# Altium schematic sheet Z7_POWER1.SchDoc
size A3
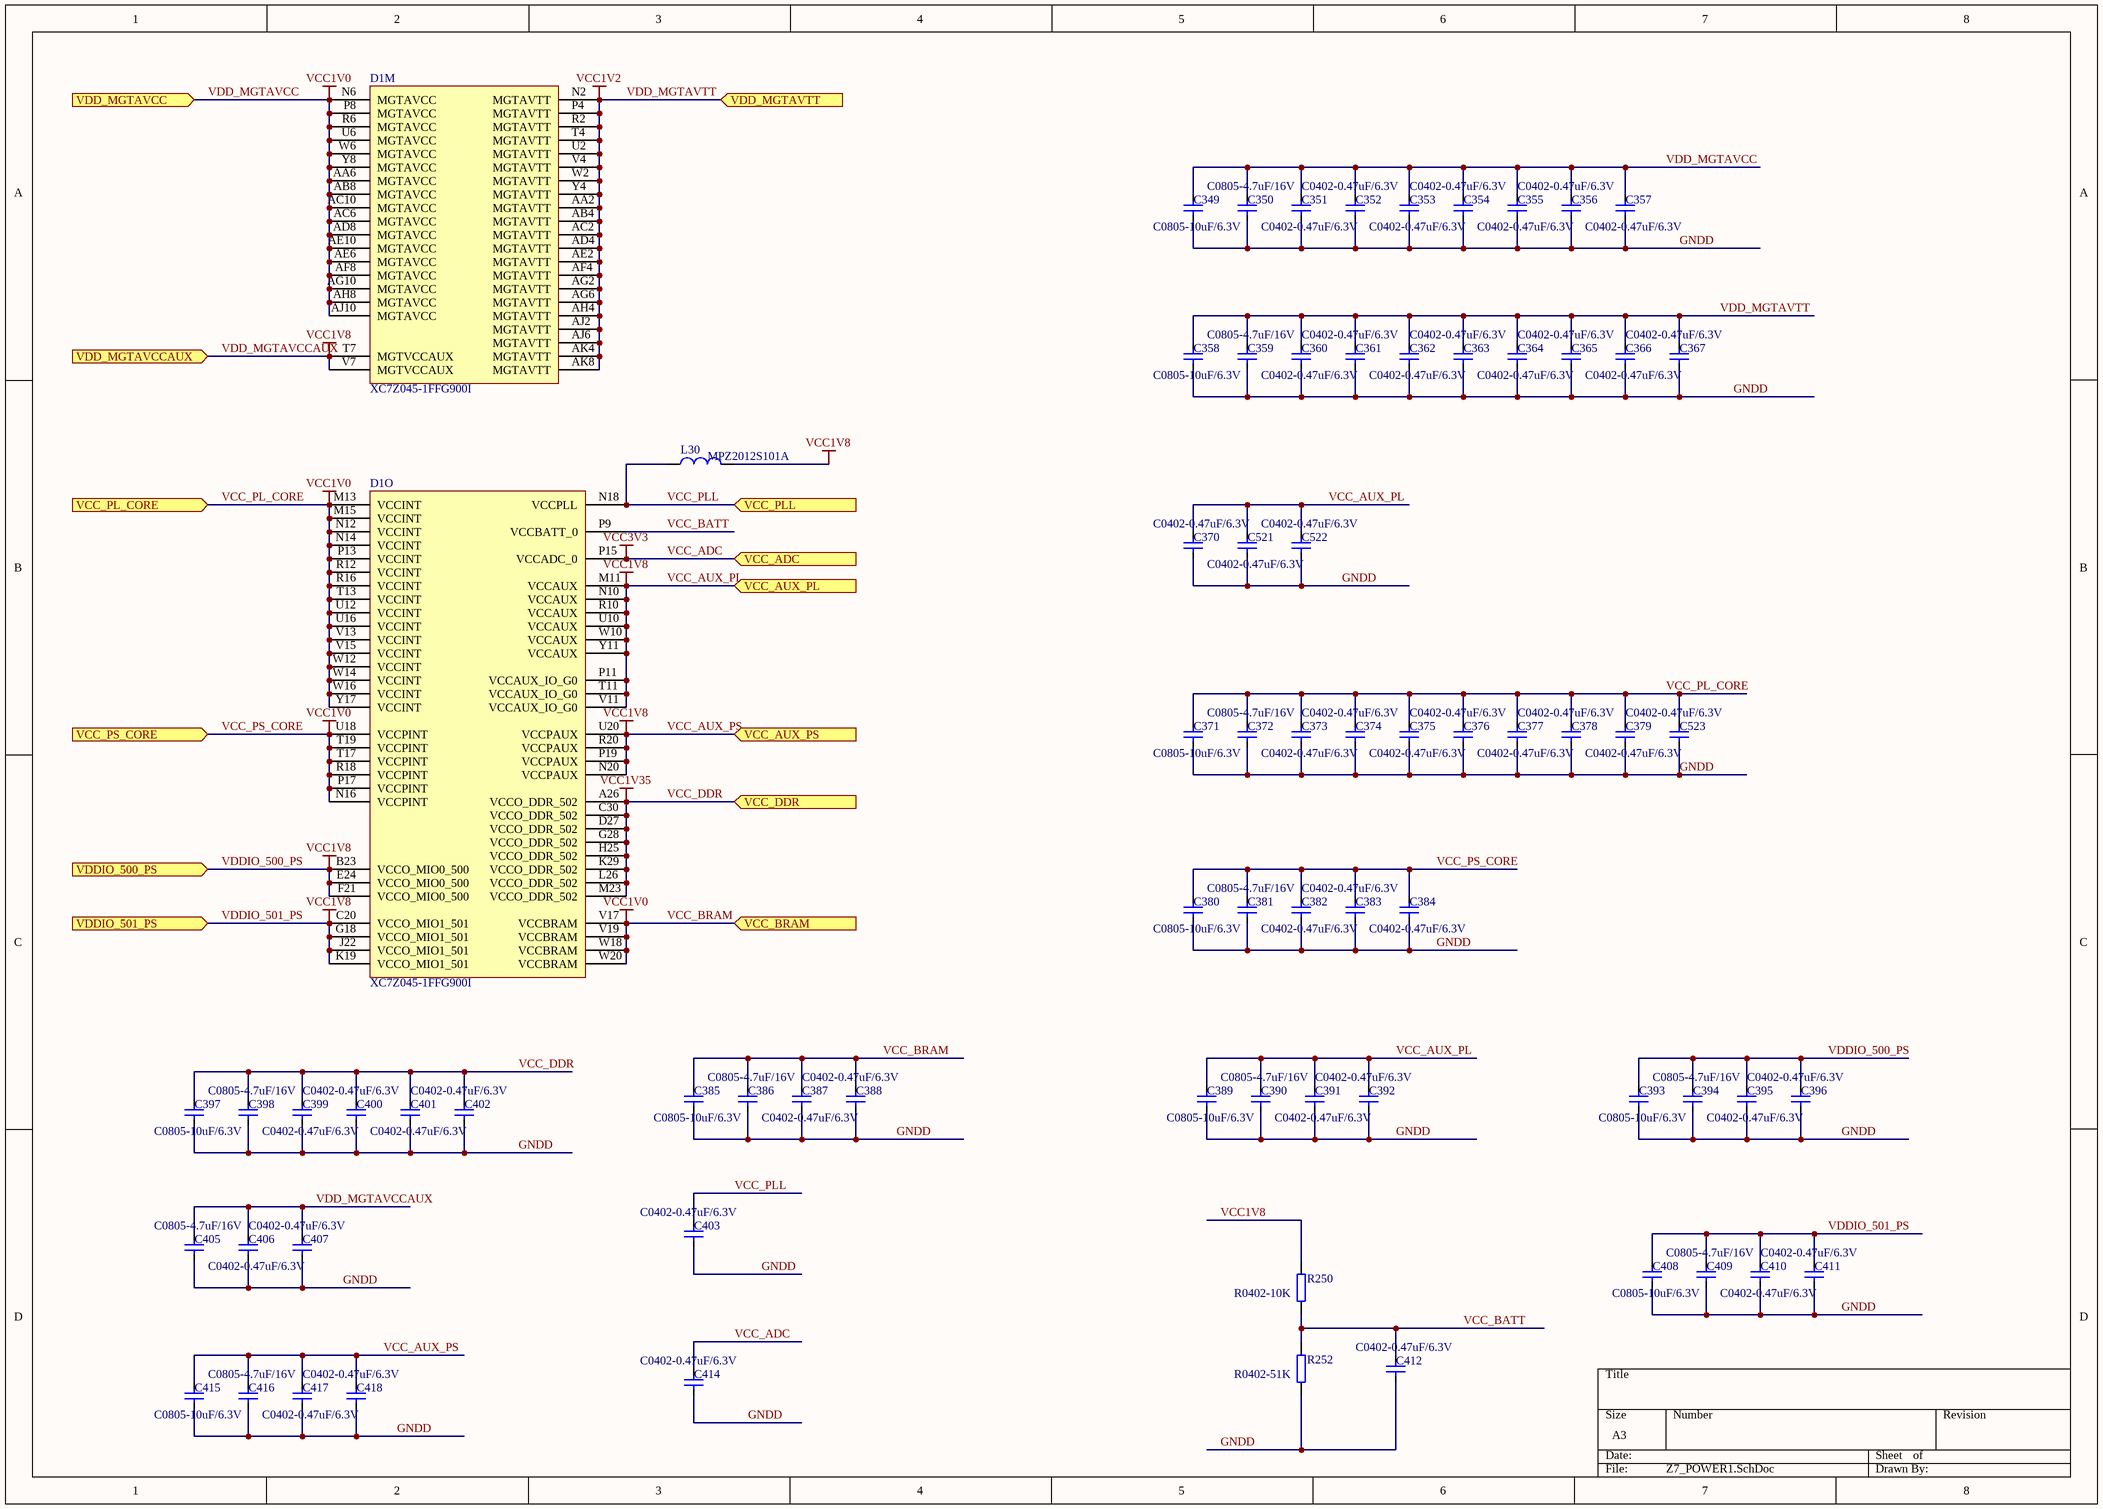
[diagram p0: Z7_POWER1.SchDoc]

## Parts
C349  C0805-10uF/6.3V  [C0805]
C350  C0805-4.7uF/16V  [C0805]
C351  C0402-0.47uF/6.3V  [C0402]
C352  C0402-0.47uF/6.3V  [C0402]
C353  C0402-0.47uF/6.3V  [C0402]
C354  C0402-0.47uF/6.3V  [C0402]
C355  C0402-0.47uF/6.3V  [C0402]
C356  C0402-0.47uF/6.3V  [C0402]
C357  C0402-0.47uF/6.3V  [C0402]
C358  C0805-10uF/6.3V  [C0805]
C359  C0805-4.7uF/16V  [C0805]
C360  C0402-0.47uF/6.3V  [C0402]
C361  C0402-0.47uF/6.3V  [C0402]
C362  C0402-0.47uF/6.3V  [C0402]
C363  C0402-0.47uF/6.3V  [C0402]
C364  C0402-0.47uF/6.3V  [C0402]
C365  C0402-0.47uF/6.3V  [C0402]
C366  C0402-0.47uF/6.3V  [C0402]
C367  C0402-0.47uF/6.3V  [C0402]
C370  C0402-0.47uF/6.3V  [C0402]
C371  C0805-10uF/6.3V  [C0805]
C372  C0805-4.7uF/16V  [C0805]
C373  C0402-0.47uF/6.3V  [C0402]
C374  C0402-0.47uF/6.3V  [C0402]
C375  C0402-0.47uF/6.3V  [C0402]
C376  C0402-0.47uF/6.3V  [C0402]
C377  C0402-0.47uF/6.3V  [C0402]
C378  C0402-0.47uF/6.3V  [C0402]
C379  C0402-0.47uF/6.3V  [C0402]
C380  C0805-10uF/6.3V  [C0805]
C381  C0805-4.7uF/16V  [C0805]
C382  C0402-0.47uF/6.3V  [C0402]
C383  C0402-0.47uF/6.3V  [C0402]
C384  C0402-0.47uF/6.3V  [C0402]
C385  C0805-10uF/6.3V  [C0805]
C386  C0805-4.7uF/16V  [C0805]
C387  C0402-0.47uF/6.3V  [C0402]
C388  C0402-0.47uF/6.3V  [C0402]
C389  C0805-10uF/6.3V  [C0805]
C390  C0805-4.7uF/16V  [C0805]
C391  C0402-0.47uF/6.3V  [C0402]
C392  C0402-0.47uF/6.3V  [C0402]
C393  C0805-10uF/6.3V  [C0805]
C394  C0805-4.7uF/16V  [C0805]
C395  C0402-0.47uF/6.3V  [C0402]
C396  C0402-0.47uF/6.3V  [C0402]
C397  C0805-10uF/6.3V  [C0805]
C398  C0805-4.7uF/16V  [C0805]
C399  C0402-0.47uF/6.3V  [C0402]
C400  C0402-0.47uF/6.3V  [C0402]
C401  C0402-0.47uF/6.3V  [C0402]
C402  C0402-0.47uF/6.3V  [C0402]
C403  C0402-0.47uF/6.3V  [C0402]
C405  C0805-4.7uF/16V  [C0805]
C406  C0402-0.47uF/6.3V  [C0402]
C407  C0402-0.47uF/6.3V  [C0402]
C408  C0805-10uF/6.3V  [C0805]
C409  C0805-4.7uF/16V  [C0805]
C410  C0402-0.47uF/6.3V  [C0402]
C411  C0402-0.47uF/6.3V  [C0402]
C412  C0402-0.47uF/6.3V  [C0402]
C414  C0402-0.47uF/6.3V  [C0402]
C415  C0805-10uF/6.3V  [C0805]
C416  C0805-4.7uF/16V  [C0805]
C417  C0402-0.47uF/6.3V  [C0402]
C418  C0402-0.47uF/6.3V  [C0402]
C521  C0402-0.47uF/6.3V  [C0402]
C522  C0402-0.47uF/6.3V  [C0402]
C523  C0402-0.47uF/6.3V  [C0402]
D1  XC7Z045-1FFG900I  [FFG900]  (parts M,O of 16)
L30  MPZ2012S101A  [R0805]
R250  R0402-10K  [R0402]
R252  R0402-51K  [R0402]

## Ports
VCC_ADC (in), VCC_AUX_PL (in), VCC_AUX_PS (in), VCC_BRAM (in), VCC_DDR (in), VCC_PL_CORE (in), VCC_PLL (in), VCC_PS_CORE (in), VDD_MGTAVCC (in), VDD_MGTAVCCAUX (in), VDD_MGTAVTT (in), VDDIO_500_PS (in), VDDIO_501_PS (in)

## Nets
VCC1V8: C370.1 C389.1 C390.1 C391.1 C392.1 C393.1 C394.1 C395.1 C396.1 C405.1 C406.1 C407.1 C408.1 C409.1 C410.1 C411.1 C415.1 C416.1 C417.1 C418.1 C521.1 C522.1 D1.B23(VCCO_MIO0_500) D1.C20(VCCO_MIO1_501) D1.E24(VCCO_MIO0_500) D1.F21(VCCO_MIO0_500) D1.G18(VCCO_MIO1_501) D1.J22(VCCO_MIO1_501) D1.K19(VCCO_MIO1_501) D1.M11(VCCAUX) D1.N10(VCCAUX) D1.N20(VCCPAUX) D1.P11(VCCAUX_IO_G0) D1.P19(VCCPAUX) D1.R10(VCCAUX) D1.R20(VCCPAUX) D1.T7(MGTVCCAUX) D1.T11(VCCAUX_IO_G0) D1.U10(VCCAUX) D1.U20(VCCPAUX) D1.V7(MGTVCCAUX) D1.V11(VCCAUX_IO_G0) D1.W10(VCCAUX) D1.Y11(VCCAUX) L30.2 R250.2 ; port VDD_MGTAVCCAUX, port VDDIO_501_PS, port VCC_AUX_PL, port VCC_AUX_PS, port VDDIO_500_PS  [also labelled VCC_AUX_PL, VCC_AUX_PS, VDD_MGTAVCCAUX, VDDIO_500_PS, VDDIO_501_PS]
VCC_ADC: C414.1 D1.P15(VCCADC_0) ; port VCC_ADC  [also labelled VCC3V3]
VCC_BRAM: C349.1 C350.1 C351.1 C352.1 C353.1 C354.1 C355.1 C356.1 C357.1 C371.1 C372.1 C373.1 C374.1 C375.1 C376.1 C377.1 C378.1 C379.1 C380.1 C381.1 C382.1 C383.1 C384.1 C385.1 C386.1 C387.1 C388.1 C523.1 D1.AA6(MGTAVCC) D1.AB8(MGTAVCC) D1.AC6(MGTAVCC) D1.AC10(MGTAVCC) D1.AD8(MGTAVCC) D1.AE6(MGTAVCC) D1.AE10(MGTAVCC) D1.AF8(MGTAVCC) D1.AG10(MGTAVCC) D1.AH8(MGTAVCC) D1.AJ10(MGTAVCC) D1.M13(VCCINT) D1.M15(VCCINT) D1.N6(MGTAVCC) D1.N12(VCCINT) D1.N14(VCCINT) D1.N16(VCCPINT) D1.P8(MGTAVCC) D1.P13(VCCINT) D1.P17(VCCPINT) D1.R6(MGTAVCC) D1.R12(VCCINT) D1.R16(VCCINT) D1.R18(VCCPINT) D1.T13(VCCINT) D1.T17(VCCPINT) D1.T19(VCCPINT) D1.U6(MGTAVCC) D1.U12(VCCINT) D1.U16(VCCINT) D1.U18(VCCPINT) D1.V13(VCCINT) D1.V15(VCCINT) D1.V17(VCCBRAM) D1.V19(VCCBRAM) D1.W6(MGTAVCC) D1.W12(VCCINT) D1.W14(VCCINT) D1.W16(VCCINT) D1.W18(VCCBRAM) D1.W20(VCCBRAM) D1.Y8(MGTAVCC) D1.Y17(VCCINT) ; port VDD_MGTAVCC, port VCC_PL_CORE, port VCC_PS_CORE, port VCC_BRAM  [also labelled VCC1V0, VCC_PL_CORE, VCC_PS_CORE, VDD_MGTAVCC]
VCC_DDR: C397.1 C398.1 C399.1 C400.1 C401.1 C402.1 D1.A26(VCCO_DDR_502) D1.C30(VCCO_DDR_502) D1.D27(VCCO_DDR_502) D1.G28(VCCO_DDR_502) D1.H25(VCCO_DDR_502) D1.K29(VCCO_DDR_502) D1.L26(VCCO_DDR_502) D1.M23(VCCO_DDR_502) ; port VCC_DDR  [also labelled VCC1V35]
VDD_MGTAVTT: C358.1 C359.1 C360.1 C361.1 C362.1 C363.1 C364.1 C365.1 C366.1 C367.1 D1.AA2(MGTAVTT) D1.AB4(MGTAVTT) D1.AC2(MGTAVTT) D1.AD4(MGTAVTT) D1.AE2(MGTAVTT) D1.AF4(MGTAVTT) D1.AG2(MGTAVTT) D1.AG6(MGTAVTT) D1.AH4(MGTAVTT) D1.AJ2(MGTAVTT) D1.AJ6(MGTAVTT) D1.AK4(MGTAVTT) D1.AK8(MGTAVTT) D1.N2(MGTAVTT) D1.P4(MGTAVTT) D1.R2(MGTAVTT) D1.T4(MGTAVTT) D1.U2(MGTAVTT) D1.V4(MGTAVTT) D1.W2(MGTAVTT) D1.Y4(MGTAVTT) ; port VDD_MGTAVTT  [also labelled VCC1V2]
GNDD: C349.2 C350.2 C351.2 C352.2 C353.2 C354.2 C355.2 C356.2 C357.2 C358.2 C359.2 C360.2 C361.2 C362.2 C363.2 C364.2 C365.2 C366.2 C367.2 C370.2 C371.2 C372.2 C373.2 C374.2 C375.2 C376.2 C377.2 C378.2 C379.2 C380.2 C381.2 C382.2 C383.2 C384.2 C385.2 C386.2 C387.2 C388.2 C389.2 C390.2 C391.2 C392.2 C393.2 C394.2 C395.2 C396.2 C397.2 C398.2 C399.2 C400.2 C401.2 C402.2 C403.2 C405.2 C406.2 C407.2 C408.2 C409.2 C410.2 C411.2 C412.2 C414.2 C415.2 C416.2 C417.2 C418.2 C521.2 C522.2 C523.2 R252.1
VCC_BATT: C412.1 D1.P9(VCCBATT_0) R250.1 R252.2
VCC_PLL: C403.1 D1.N18(VCCPLL) L30.1 ; port VCC_PLL

## Library data of the parts
C349 C358 C371 C380 C385 C389 C393 C397 C408 C415 = C1210-22uF/16V: Part_number: C0805-10uF/6.3V; Part_type: CAP; Value: C0805-10uF/6.3V; Schematic_Part: CAP; PCB_Footprint: C0805
C350 C359 C372 C381 C386 C390 C394 C398 C405 C409 C416 = C0805-4.7uF/50V: X7R; Manufacturer: SAMSUNG; Part_number: C0805-4.7uF/16V; Part_type: CAP; Value: C0805-4.7uF/16V; Schematic_Part: CAP; PCB_Footprint: C0805; datasheet: #DataSheet\C_Samsung_General Capacitors.pdf#
C351-C357 C360-C367 C370 C373-C379 C382-C384 C387 C388 C391 C392 C395 C396 C399-C403 C406 C407 C410-C412 C414 C417 C418 C521-C523 = C0402-0.1uF/16V: X7R; Manufacturer: SAMSUNG; Manufacturer_p/n: CL05X7R104KO5NNN; Part_number: C0402-0.47uF/6.3V; Part_type: CAP; Value: C0402-0.47uF/6.3V; temperature: -55℃\+125℃; Schematic_Part: CAP; PCB_Footprint: C0402; datasheet: #DataSheet\C_Samsung_General Capacitors.pdf#
D1 = XC7Z045-1FFG900I: 667 MHz Zynq?7000 AP SoC, 130 PS I/O, 378 FPGA I/O, 900-Ball BGA, Speed Grade 1, Industrial Grade, Pb-Free; Manufacturer: Xilinx; Extensible Block RAM (# 36Kb Blocks): 2180 KB (545); Flip Flops: 437200; LUTs: 218600; Speed Grade: -1; DatasheetVersion: v1.2; PackageVersion: Rev 1.1; PackageReference: FFG900; PackageDescription: Flip-Chip BGA, Body 31 x 31 mm, 1.0 mm Pitch; Generic Part Number: XC7Z045; RoHS: Pb-Free; Mounting Technology: Surface Mount; Code_JEDEC: MS-034-AAN-1; PartNumber: XC7Z045-1FFG900I; ComponentLink1Description: Datasheet; ComponentLink1URL: http://www.xilinx.com/support/documentation/data_sheets/ds190-Zynq-7000-Overview.pdf; ComponentLink2Description: Package Specification; ComponentLink2URL: http://www.xilinx.com/support/documentation/user_guides/ug865-Zynq-7000-Pkg-Pinout.pdf; ComponentLink3Description: DC and AC Switching Characteristics; ComponentLink3URL: http://www.xilinx.com/support/documentation/data_sheets/ds191-XC7Z030-XC7Z045-data-sheet.pdf; ComponentLink4Description: Package File; ComponentLink4URL: http://www.xilinx.com/support/packagefiles/z7packages/xc7z045ffg900pkg.txt; ComponentLink5Description: Packaging and Pinout; ComponentLink5URL: http://www.xilinx.com/support/documentation/user_guides/ug865-Zynq-7000-Pkg-Pinout.pdf; ComponentLink6Description: PCB and Layout Guide; ComponentLink6URL: http://www.xilinx.com/support/documentation/user_guides/ug483_7Series_PCB.pdf
L30 = FB0805-330R@100MHz: Manufacturer: TDK; Part_number: MPZ2012S101A; Part_type: BEAD; temperature: -55℃\+125℃; Value1: 330R@100MHz; Schematic_Part: BEAD; PCB_Footprint: R0805; Manufacturer_p/n: MPZ2012S101A
R250 R252 = R0402-10K: Manufacturer: SAMSUNG; Part_type: RES; Schematic_Part: RES; PCB_Footprint: R0402
  R250: Part_number: R0402-10K; Value: R0402-10K
  R252: Part_number: R0402-51K; Value: R0402-51K